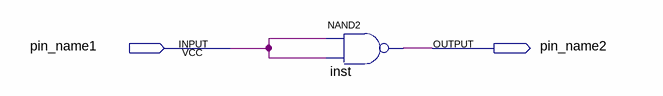
[diagram p0: schematic sheet]
// Quartus schematic inversor.bdf as structural Verilog: 1 symbols, 2 pins
module inversor (
  input  pin_name1,
  output pin_name2
);

  nand inst (pin_name2, pin_name1, pin_name1);
endmodule
